# Altium schematic sheet Pre-Amp_2017.SchDoc
size A4
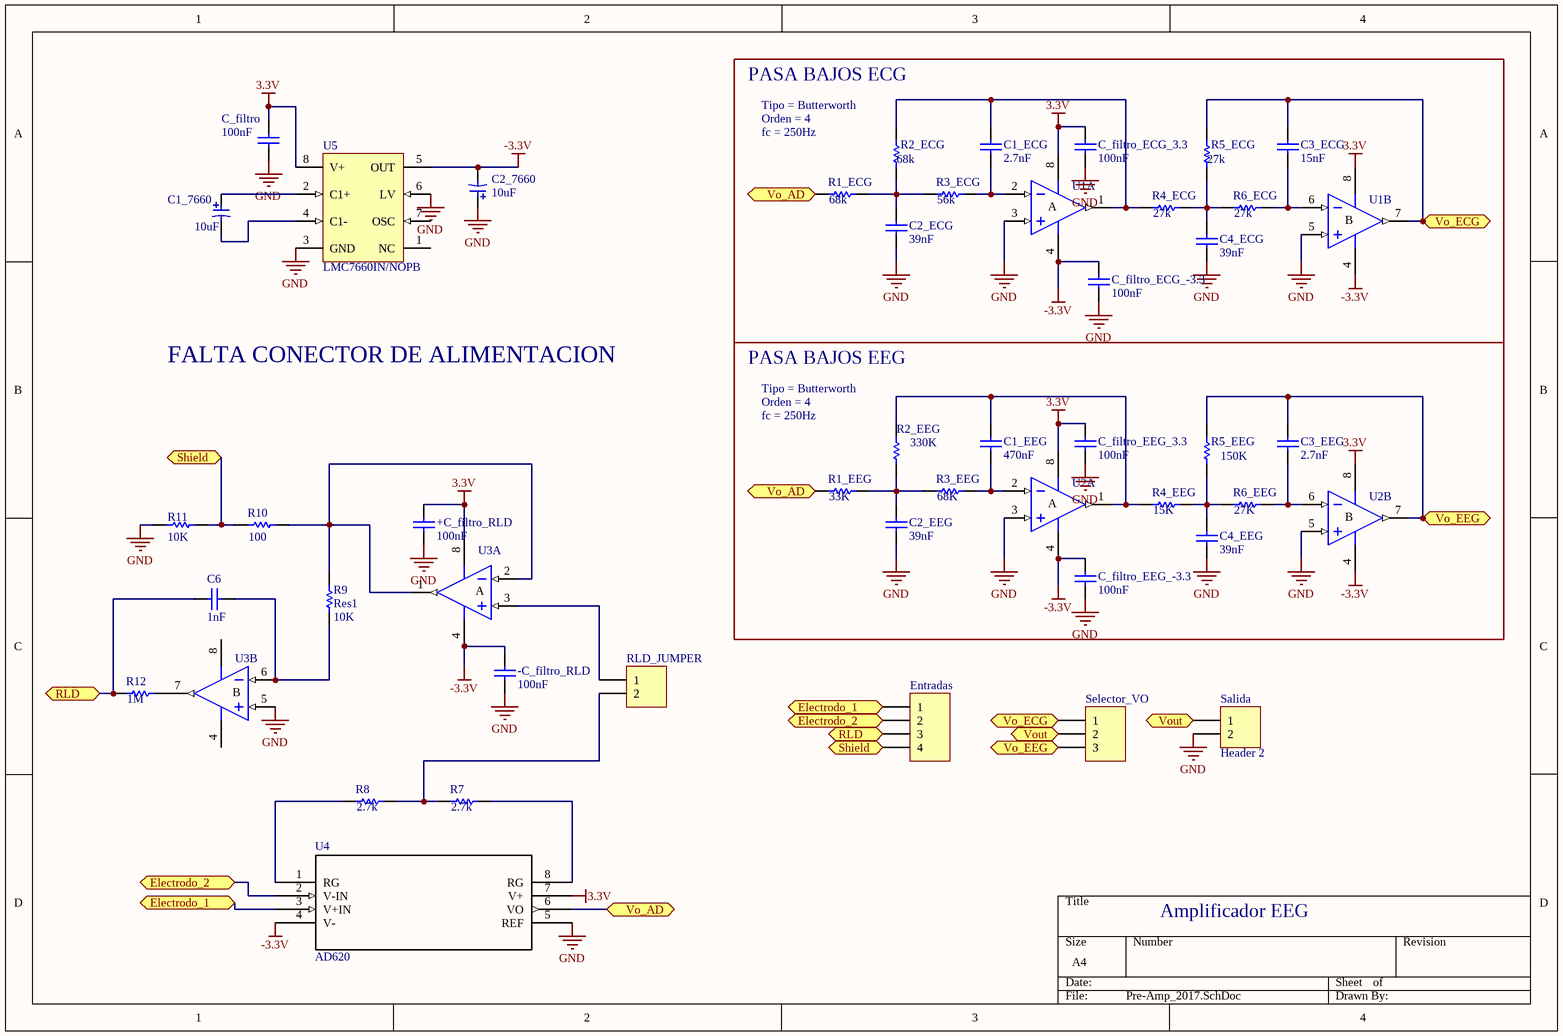
[diagram p0: Pre-Amp_2017.SchDoc]

## Parts
+C_filtro_RLD  100nF  [VP40]
-C_filtro_RLD  100nF  [VP40]
C1_7660  value 10uF  [C Elec TH V 4x7-2.5]  (hidden comment: C Pol)
C1_ECG  2.7nF  [VP40]
C1_EEG  470nF  [VP40]
C2_7660  value 10uF  [C Elec TH V 4x7-2.5]  (hidden comment: C Pol)
C2_ECG  39nF  [VP40]
C2_EEG  39nF  [VP40]
C3_ECG  15nF  [VP40]
C3_EEG  2.7nF  [VP40]
C4_ECG  39nF  [VP40]
C4_EEG  39nF  [VP40]
C6  1nF  [VP40]
C_filtro  100nF  [VP31-3.2]
C_filtro_ECG_3.3  100nF  [VP40]
C_filtro_ECG_-3.3  100nF  [VP40]
C_filtro_EEG_3.3  100nF  [VP40]
C_filtro_EEG_-3.3  100nF  [VP40]
Entradas  Header 4  [HDR1X4]  (value not drawn)
R1_ECG  value 68k  [AXIAL-0.3]  (hidden comment: Res1)
R1_EEG  value 33K  [AXIAL-0.3]  (hidden comment: Res1)
R2_ECG  value 68k  [AXIAL-0.3]  (hidden comment: Res1)
R2_EEG  value 330K  [AXIAL-0.3]  (hidden comment: Res1)
R3_ECG  value 56k  [AXIAL-0.3]  (hidden comment: Res1)
R3_EEG  value 68K  [AXIAL-0.3]  (hidden comment: Res1)
R4_ECG  value 27k  [AXIAL-0.3]  (hidden comment: Res1)
R4_EEG  value 15K  [AXIAL-0.3]  (hidden comment: Res1)
R5_ECG  value 27k  [AXIAL-0.3]  (hidden comment: Res1)
R5_EEG  value 150K  [AXIAL-0.3]  (hidden comment: Res1)
R6_ECG  value 27k  [AXIAL-0.3]  (hidden comment: Res1)
R6_EEG  value 27K  [AXIAL-0.3]  (hidden comment: Res1)
R7  value 2.7k  [AXIAL-0.3]  (hidden comment: Res1)
R8  value 2.7k  [AXIAL-0.3]  (hidden comment: Res1)
R9  Res1  value 10K  [AXIAL-0.3]
R10  100  [AXIAL-0.3]
R11  value 10K  [AXIAL-0.3]  (hidden comment: Res1)
R12  value 1M  [AXIAL-0.3]  (hidden comment: Res1)
RLD_JUMPER  Header 2  [HDR1X2]  (value not drawn)
Salida  Header 2  [HDR1X2]
Selector_VO  Header 3  [HDR1X3]  (value not drawn)
U1  LT1358CN8  [N8]  (value not drawn)  (parts A,B of 2)
U2  LT1358CN8  [N8]  (value not drawn)  (parts A,B of 2)
U3  LT1358CN8  [N8]  (value not drawn)  (parts A,B of 2)
U4  AD620  [DIP8]
U5  LMC7660IN/NOPB  [N08E]

## Blocks framed on the sheet
PASA BAJOS ECG: C1_ECG C2_ECG C3_ECG C4_ECG C_filtro_ECG_3.3 C_filtro_ECG_-3.3 R1_ECG R2_ECG R3_ECG R4_ECG R5_ECG R6_ECG U1
PASA BAJOS EEG: C1_EEG C2_EEG C3_EEG C4_EEG C_filtro_EEG_3.3 C_filtro_EEG_-3.3 R1_EEG R2_EEG R3_EEG R4_EEG R5_EEG R6_EEG U2

## Ports
Electrodo_1, Electrodo_2, RLD, Shield, Vo_AD, Vo_ECG, Vo_EEG, Vout

## Nets
3.3V: +C_filtro_RLD.2 C_filtro.2 C_filtro_ECG_3.3.2 C_filtro_EEG_3.3.2 U1.8(V+) U2.8(V+) U3.8(V+) U4.7(V+) U5.8(V+)
-3.3V: -C_filtro_RLD.2 C2_7660.1 C_filtro_ECG_-3.3.2 C_filtro_EEG_-3.3.2 U1.4(V-) U2.4(V-) U3.4(V-) U4.4(V-) U5.5(OUT)
GND: +C_filtro_RLD.1 -C_filtro_RLD.1 C2_7660.2 C2_ECG.1 C2_EEG.1 C4_ECG.1 C4_EEG.1 C_filtro.1 C_filtro_ECG_3.3.1 C_filtro_ECG_-3.3.1 C_filtro_EEG_3.3.1 C_filtro_EEG_-3.3.1 R11.2 Salida.2 U1.3(IN+) U1.5(IN+) U2.3(IN+) U2.5(IN+) U3.5(IN+) U4.5(REF) U5.3(GND) U5.6(LV)
Electrodo_1: Entradas.1 U4.3(V+IN) ; port Electrodo_1
Electrodo_2: Entradas.2 U4.2(V-IN) ; port Electrodo_2
RLD: C6.1 Entradas.3 R12.2 ; port RLD
Shield: Entradas.4 R10.2 R11.1 ; port Shield
Vo_AD: R1_ECG.1 R1_EEG.1 U4.6(VO) ; port Vo_AD
Vo_ECG: C3_ECG.2 R5_ECG.2 Selector_VO.1 U1.7(OUT) ; port Vo_ECG
Vo_EEG: C3_EEG.2 R5_EEG.2 Selector_VO.3 U2.7(OUT) ; port Vo_EEG
Vout: Salida.1 Selector_VO.2 ; port Vout
NetC1_7660_1: C1_7660.1 U5.4(C1-)
NetC1_7660_2: C1_7660.2 U5.2(C1+)
NetC1_ECG_1: C1_ECG.1 R3_ECG.2 U1.2(IN-)
NetC1_ECG_2: C1_ECG.2 R2_ECG.1 R4_ECG.1 U1.1(OUT)
NetC1_EEG_1: C1_EEG.1 R3_EEG.2 U2.2(IN-)
NetC1_EEG_2: C1_EEG.2 R2_EEG.1 R4_EEG.1 U2.1(OUT)
NetC2_ECG_2: C2_ECG.2 R1_ECG.2 R2_ECG.2 R3_ECG.1
NetC2_EEG_2: C2_EEG.2 R1_EEG.2 R2_EEG.2 R3_EEG.1
NetC3_ECG_1: C3_ECG.1 R6_ECG.1 U1.6(IN-)
NetC3_EEG_1: C3_EEG.1 R6_EEG.1 U2.6(IN-)
NetC4_ECG_2: C4_ECG.2 R4_ECG.2 R5_ECG.1 R6_ECG.2
NetC4_EEG_2: C4_EEG.2 R4_EEG.2 R5_EEG.1 R6_EEG.2
NetC6_2: C6.2 R9.1 U3.6(IN-)
NetR7_1: R7.1 R8.2 RLD_JUMPER.2
NetR7_2: R7.2 U4.8(RG)
NetR8_1: R8.1 U4.1(RG)
NetR9_2: R9.2 R10.1 U3.1(OUT) U3.2(IN-)
NetR12_1: R12.1 U3.7(OUT)
NetRLD_JUMPER_1: RLD_JUMPER.1 U3.3(IN+)

Not connected (* = marked no-connect by the designer): U5 1(NC) 7(OSC)

## Notes on the sheet
- (near R2_ECG) Tipo = Butterworth
- fc = 250Hz
- Orden = 4
- FALTA CONECTOR DE ALIMENTACION
- (near R2_EEG) Tipo = Butterworth
- Amplificador EEG
- (in symbol LT1358CN8, part A) A
- (in symbol LT1358CN8, part B) B

## Library data of the parts
+C_filtro_RLD -C_filtro_RLD C1_ECG C1_EEG C2_ECG C2_EEG C3_ECG C3_EEG C4_ECG C4_EEG C6 C_filtro_ECG_3.3 C_filtro_ECG_-3.3 C_filtro_EEG_3.3 C_filtro_EEG_-3.3 = VP40BA181KA: Dipped Radial Multilayer Ceramic Capacitor COG (NPO): 180pF, 50/63V; Note: See Datasheet for other packages & tolerances; Published: 17-Dec-2003; DatasheetDocument: 2-Jan-2002; PackageDocument: 8-Feb-2002; PackageReference: VP40; Publisher: Altium Limited; ComponentLink1Description: Manufacturer Link; ComponentLink1URL: http://www.vishay.com/; Value: 180pF
C1_7660 C2_7660 = C Pol: Capacitor, polarized, generic
C_filtro = VP31BA820KC: Dipped Radial Multilayer Ceramic Capacitor COG (NPO): 82pF, 200V; Published: 17-Dec-2003; DatasheetDocument: 7-Jan-2002; PackageDocument: 7-Jan-2002; PackageReference: VP31-3.2; Publisher: Altium Limited; ComponentLink1Description: Manufacturer Link; ComponentLink1URL: http://www.vishay.com/; Value: 82pF
Entradas = Header 4: Header, 4-Pin; LatestRevisionDate: 17-Jul-2002; LatestRevisionNote: Re-released for DXP Platform.; Publisher: Altium Limited
R1_ECG R1_EEG R2_ECG R2_EEG R3_ECG R3_EEG R4_ECG R4_EEG R5_ECG R5_EEG R6_ECG R6_EEG R7-R12 = Res1: Resistor; Published: 8-Jun-2000; LatestRevisionDate: 17-Jul-2002; LatestRevisionNote: Re-released for DXP Platform.; PackageReference: AXIAL-0.3; Publisher: Altium Limited; PackageDescription: Axial Device, Thru-Hole; 2 Leads; 0.3 in Pin Spacing
  R10: Value: 100
RLD_JUMPER Salida = Header 2: Header, 2-Pin; LatestRevisionDate: 17-Jul-2002; LatestRevisionNote: Re-released for DXP Platform.; Publisher: Altium Limited
Selector_VO = Header 3: Header, 3-Pin; LatestRevisionDate: 17-Jul-2002; LatestRevisionNote: Re-released for DXP Platform.; Publisher: Altium Limited
U1-U3 = LT1358CN8: Dual 25MHz, 600V/µs Operational Amplifier; Note: 1124; Published: 8-Jun-2000; LatestRevisionDate: 29-May-2009; LatestRevisionNote: Component Body Added.; DatasheetVersion: 1996; PackageVersion: N8 1002; PackageReference: N8; Publisher: Altium Limited; PackageDescription: DIP, Plastic, 8-Pin, Row Spacing 7.62 mm, Pitch 2.54 mm; ComponentLink1Description: Manufacturer Link; ComponentLink1URL: http://www.linear.com/; ComponentLink2Description: Datasheet; ComponentLink2URL: http://www.linear.com/pc/downloadDocument.do?navId=H0,C1,C1154,C1009,C1022,P1113,D3374
U4 = INA129
U5 = LMC7660IN/NOPB: Switched Capacitor Voltage Converter, 8-pin MDIP, Pb-Free; Manufacturer: National Semiconductor; PackageTopMarking: NSUZXYTTE#*LMC*7660IN; PowerWise: N; CompType: Switch Caps; High-Reliability: Y; DatasheetVersion: Feb-2005; PackageVersion: revG, May-2006; PackageReference: N08E; PackageDescription: MDIP, .365 x .250 x .130in, 8 Lead, .100in Pitch; PartNumber: LMC7660IN/NOPB; RoHS: Y; PinCount: 8; Code_JEDEC: MS-001-BA; ComponentLink1Description: Manufacturer URL; ComponentLink1URL: http://www.national.com/; ComponentLink2Description: LMC7660 Datasheet; ComponentLink2URL: http://www.national.com/ds/LM/LMC7660.pdf; ComponentLink3Description: LMC7660 Web Page; ComponentLink3URL: http://www.national.com/pf/LM/LMC7660.html; ComponentLink4Description: N08E Package Page; ComponentLink4URL: http://www.national.com/packaging/folders/n08e.html